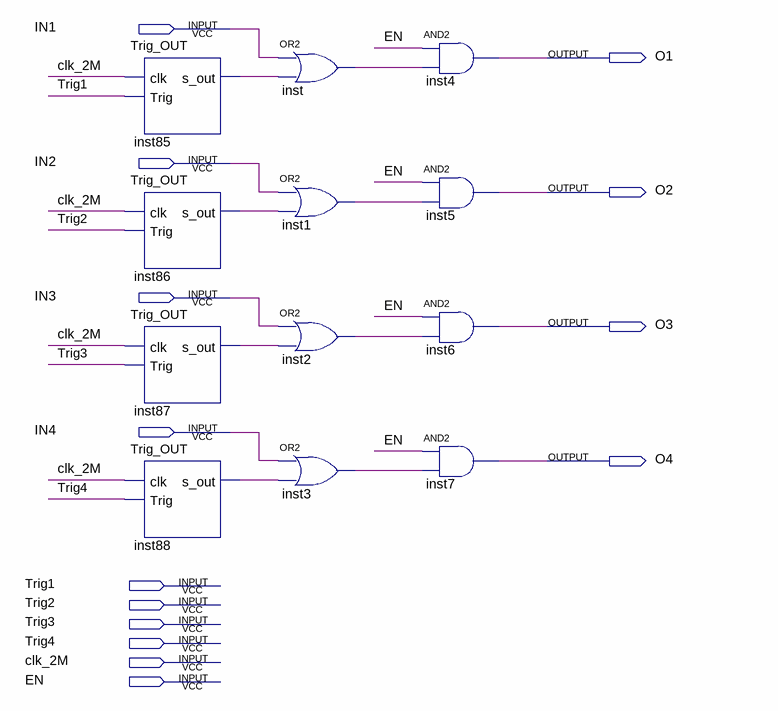
[diagram p0: schematic sheet]
// Quartus schematic SYN_OUT_CTR.bdf as structural Verilog: 12 symbols, 14 pins
module SYN_OUT_CTR (
  input  IN1,
  input  IN2,
  input  IN3,
  input  IN4,
  input  Trig1,
  input  Trig2,
  input  Trig3,
  input  Trig4,
  input  clk_2M,
  input  EN,
  output O1,
  output O2,
  output O3,
  output O4
);

  wire inst1_out, inst2_out, inst3_out, inst85_s_out, inst86_s_out, inst87_s_out, inst88_s_out, inst_out;

  Trig_OUT inst85 (.clk(clk_2M), .Trig(Trig1), .s_out(inst85_s_out));
  Trig_OUT inst86 (.clk(clk_2M), .Trig(Trig2), .s_out(inst86_s_out));
  Trig_OUT inst87 (.clk(clk_2M), .Trig(Trig3), .s_out(inst87_s_out));
  Trig_OUT inst88 (.clk(clk_2M), .Trig(Trig4), .s_out(inst88_s_out));
  or inst (inst_out, IN1, inst85_s_out);
  or inst1 (inst1_out, IN2, inst86_s_out);
  or inst2 (inst2_out, IN3, inst87_s_out);
  or inst3 (inst3_out, IN4, inst88_s_out);
  and inst4 (O1, EN, inst_out);
  and inst5 (O2, EN, inst1_out);
  and inst6 (O3, EN, inst2_out);
  and inst7 (O4, EN, inst3_out);
endmodule
